# Altium schematic sheet TYPEC.schdoc
size 127 x 101 mm
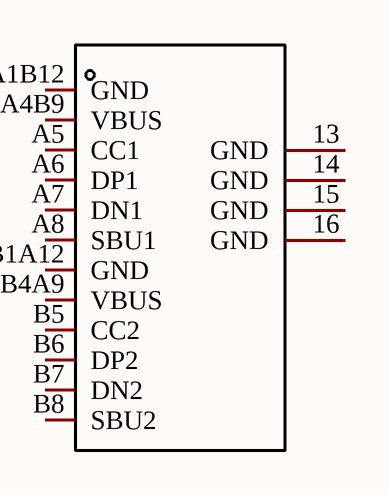
[diagram p0: TYPEC.schdoc]

## Parts
USB?  TYPEC-304-BCP16_C720629  (value not drawn)

## Nets

Not connected (* = marked no-connect by the designer): USB? 13(GND) 14(GND) 15(GND) 16(GND) A1B12(GND) A4B9(VBUS) A5(CC1) A6(DP1) A7(DN1) A8(SBU1) B1A12(GND) B4A9(VBUS) B5(CC2) B6(DP2) B7(DN2) B8(SBU2)

## Library data of the parts
USB? = TYPEC-304-BCP16_C720629: Manufacturer: XUNPU(讯普); Add into BOM: yes; Connector Type: Type-C; Gender: 母座; Number of Contacts: 16; Number of Ports: 1; Current Rating - Power (Max): 3A; Welding Temperature (Max): 260℃; Name: TYPEC-304-BCP16; Symbol: TYPEC-304-BCP16; Device: TYPEC-304-BCP16_C720629; LCSC Part Name: Type-C 母座 卧贴 停产 停产; Supplier Part: C720629; Manufacturer Part: TYPEC-304-BCP16; Supplier Footprint: SMD; JLCPCB Part Class: Extended Part; Datasheet: https://atta.szlcsc.com/upload/public/pdf/source/20220210/1FE0FEFF7D6A20C111212527D3DED014.pdf; Supplier: LCSC; Convert to PCB: yes; Standard: USB 3.1; Mounting Style: 卧贴; Operating Temperature Range: -25℃~+85℃